# EAGLE design current_stub (EAGLE 7.2.0)
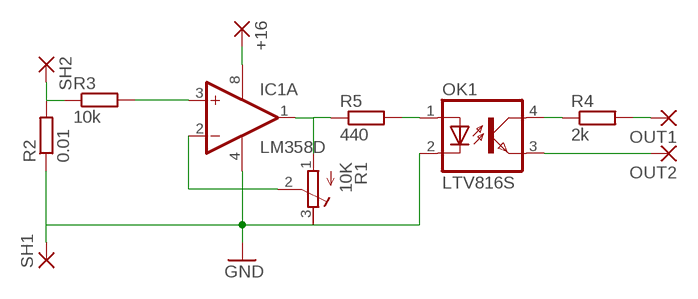
[diagram p0: schematic, sheet 1]

## Parts
+16  SMD2  [SMD1,27-2,54]
IC1  LM358D  [SO08]
OK1  LTV816S  [SMD4]
OUT1  SMD2  [SMD1,27-2,54]
OUT2  SMD2  [SMD1,27-2,54]
R1  10K  R-TRIMM3296W  [RTRIM3296W]
R2  0.01  R-EU_R2512  [R2512]
R3  10k  R-EU_M0805  [M0805]
R4  2k  R-EU_M0805  [M0805]
R5  440  R-EU_M0805  [M0805]
SH1  SMD2  [SMD1,27-2,54]
SH2  SMD2  [SMD1,27-2,54]

## Nets
GND: IC1.4(P:V-) OK1.2(C) R1.3(E) R2.1 SH1.1(P)
N$1: IC1.3(A:+IN) R3.2
N$2: R2.2 R3.1 SH2.1(P)
N$3: IC1.2(A:-IN) R1.2(S)
N$4: +16.1(P) IC1.8(P:V+)
N$5: IC1.1(A:OUT) R1.1(A) R5.1
N$6: OK1.1(A) R5.2
N$7: OK1.4(COL) R4.1
N$8: OUT1.1(P) R4.2
OUT2: OK1.3(EMIT) OUT2.1(P)
Unconnected: IC1.5(B:+IN) IC1.6(B:-IN) IC1.7(B:OUT)

## Library data of the parts
+16 OUT1 OUT2 SH1 SH2 = wirepad:SMD2: SMD PAD
IC1 = linear:LM358: OP AMP also LM158; LM258; LM2904 Source: http://cache.national.com/ds/LM/LM158.pdf
OK1 = optocoupler:LTV816: OPTO COUPLER Source: LITEON, LTV816.pdf; OC_FARNELL: unknown; OC_NEWARK: unknown
R1 = rcl:R-TRIMM: Trimm resistor
R2-R5 = rcl:R-EU_: RESISTOR, European symbol

## Board
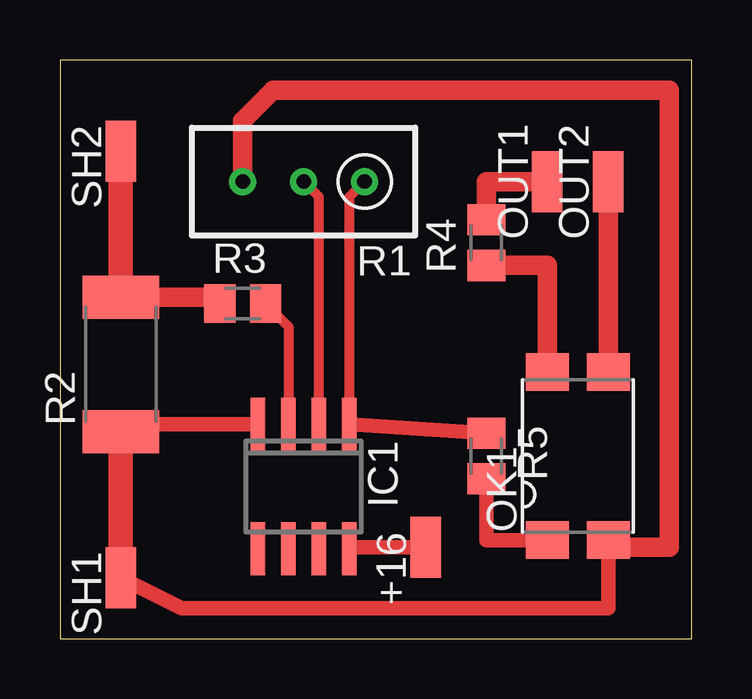
[diagram p1: board, top side]

Size 26.34 x 24.12 mm. Coordinates in mm from the lower left corner, seen from the top.
Outline: 0,0 26.34,0 26.34,24.12 0,24.12 0,0
Copper layers (1*16): Top 0.035mm / dielectric 1.5mm / Bottom 0.035mm
Design rules "default": minimum track width 10mil, minimum drill 24mil, track to track 8mil, track to pad 8mil, pad to pad 8mil, via to via 8mil, smd to smd 8mil, copper to edge 40mil, drill to drill 8mil, minimum pad ring 10mil, minimum via ring 8mil, stop-mask expansion 4mil, vias tented up to drill 0mil, thermal gap 10mil

### Footprints (pad centres in the part's own frame; a part is rotated, then mirrored left to right if it is on the bottom)
SMD1,27-2,54 = smd 1.27 x 2.54: 1 0,0
SO08 = smd 0.6 x 2.2: 1 -1.905,-2.6; 2 -0.635,-2.6; 3 0.635,-2.6; 4 1.905,-2.6; 5 1.905,2.6; 6 0.635,2.6; 7 -0.635,2.6; 8 -1.905,2.6
SMD4 = smd 1.78 x 1.55: 1 -1.27,-3.5; 2 1.27,-3.5; 3 1.27,3.5; 4 -1.27,3.5
RTRIM3296W = drill 0.61: 1 0,-2.54; 2 0,0; 3 0,2.54
R2512 = smd 1.8 x 3.2: 1 -2.8,0; 2 2.8,0
M0805 = smd 1.3 x 1.6: 1 -0.95,0; 2 0.95,0

### Placement (x,y rotation side)
+16  15.24,3.81 0 top
IC1  10.16,6.35 180 top
OK1  21.59,7.62 0 top
OUT1  20.32,19.05 0 top
OUT2  22.86,19.05 0 top
R1  10.16,19.05 90 top
R2  2.54,11.43 90 top
R3  7.62,13.97 0 top
R4  17.78,16.51 90 top
R5  17.78,7.62 270 top
SH1  2.54,2.54 0 top
SH2  2.54,20.32 0 top

### Tracks (layer width: path | path; a pad name or v marks a point on that pad's centre or on a via)
GND
  Top 0.61: IC1.4 2.86,8.95 R2.1 | OK1.2 22.86,1.27 5.08,1.27 SH1.1
  Top 0.813: R1.3 7.62,21.59 8.89,22.86 25.4,22.86 25.4,3.81 22.86,3.81 OK1.2
  Top 1.016: R2.1 SH1.1
N$1
  Top 0.406: R3.2 9.53,13.02 IC1.3
N$2
  Top 0.813: R2.2 6.67,14.23 R3.1
  Top 1.016: SH2.1 R2.2
N$3
  Top 0.406: IC1.2 10.79,18.41 R1.2
N$4
  Top 0.61: +16.1 12.12,3.81 IC1.8
N$5
  Top 0.406: IC1.1 12.06,18.41 R1.1
  Top 0.61: R5.1 IC1.1
N$6
  Top 0.61: OK1.1 17.78,4.12 R5.2
N$7
  Top 0.813: OK1.4 20.32,15.56 R4.1
N$8
  Top 0.813: 20.32,18.73 OUT1.1 17.78,19.05 R4.2
OUT2
  Top 0.813: OUT2.1 OK1.3